# EAGLE design EMG (EAGLE 8.6.0)
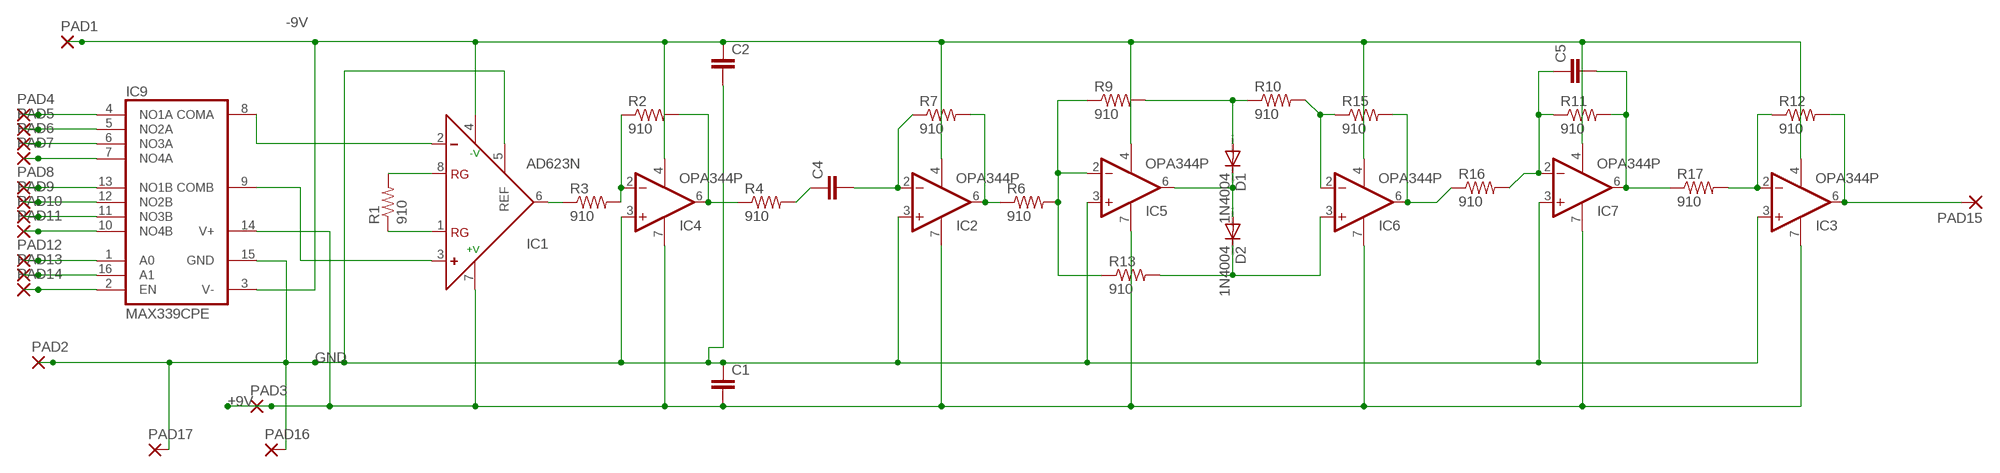
[diagram p0: schematic, sheet 1]

## Parts
C1  C2,5-3  [C2.5-3]
C2  C2,5-3  [C2.5-3]
C4  C2,5-3  [C2.5-3]
C5  C2,5-3  [C2.5-3]
D1  1N4004  [DO41-10]
D2  1N4004  [DO41-10]
IC1  AD623N  [DIL08]
IC2  OPA344P  [DIL08]
IC3  OPA344P  [DIL08]
IC4  OPA344P  [DIL08]
IC5  OPA344P  [DIL08]
IC6  OPA344P  [DIL08]
IC7  OPA344P  [DIL08]
IC9  MAX339CPE  [DIL16]
PAD1  2,15/1,0  [2,15/1,0]
PAD2  2,15/1,0  [2,15/1,0]
PAD3  2,15/1,0  [2,15/1,0]
PAD4  2,15/1,0  [2,15/1,0]
PAD5  2,15/1,0  [2,15/1,0]
PAD6  2,15/1,0  [2,15/1,0]
PAD7  2,15/1,0  [2,15/1,0]
PAD8  2,15/1,0  [2,15/1,0]
PAD9  2,15/1,0  [2,15/1,0]
PAD10  2,15/1,0  [2,15/1,0]
PAD11  2,15/1,0  [2,15/1,0]
PAD12  2,15/1,0  [2,15/1,0]
PAD13  2,15/1,0  [2,15/1,0]
PAD14  2,15/1,0  [2,15/1,0]
PAD15  2,15/1,0  [2,15/1,0]
PAD16  2,15/1,0  [2,15/1,0]
PAD17  2,15/1,0  [2,15/1,0]
R1  910  R-US_0204/7  [0204/7]
R2  910  R-US_0204/7  [0204/7]
R3  910  R-US_0204/7  [0204/7]
R4  910  R-US_0204/7  [0204/7]
R6  910  R-US_0204/7  [0204/7]
R7  910  R-US_0204/7  [0204/7]
R9  910  R-US_0204/7  [0204/7]
R10  910  R-US_0204/7  [0204/7]
R11  910  R-US_0204/7  [0204/7]
R12  910  R-US_0204/7  [0204/7]
R13  910  R-US_0204/7  [0204/7]
R15  910  R-US_0204/7  [0204/7]
R16  910  R-US_0204/7  [0204/7]
R17  910  R-US_0204/7  [0204/7]

## Nets
+9V: C1.2 IC1.7(+V) IC2.7(V+) IC3.7(V+) IC4.7(V+) IC5.7(V+) IC6.7(V+) IC7.7(V+) IC9.14(V+) PAD3.1(P)
-9V: C2.1 IC1.4(-V) IC2.4(V-) IC3.4(V-) IC4.4(V-) IC5.4(V-) IC6.4(V-) IC7.4(V-) IC9.3(V-) PAD1.1(P)
GND: C1.1 C2.2 IC1.5(REF) IC2.3(+IN) IC3.3(+IN) IC4.3(+IN) IC5.3(+IN) IC7.3(+IN) IC9.15(GND) PAD2.1(P) PAD16.1(P) PAD17.1(P)
N$1: IC1.8(RG) R1.2
N$2: IC1.1(RG) R1.1
N$3: IC1.6(OUT) R3.1
N$4: IC4.2(-IN) R2.1 R3.2
N$6: IC4.6(OUT) R2.2 R4.1
N$7: C4.1 R4.2
N$8: C4.2 IC2.2(-IN) R7.1
N$9: IC5.2(-IN) R6.2 R9.1 R13.1
N$10: D1.A R9.2 R10.1
N$11: IC2.6(OUT) R6.1 R7.2
N$12: IC6.6(OUT) R15.2 R16.1
N$13: C5.1 IC7.2(-IN) R11.1 R16.2
N$14: C5.2 IC7.6(OUT) R11.2 R17.1
N$15: IC3.2(-IN) R12.1 R17.2
N$16: IC3.6(OUT) PAD15.1(P) R12.2
N$17: D2.C IC6.3(+IN) R13.2
N$18: D1.C D2.A IC5.6(OUT)
N$19: IC6.2(-IN) R10.2 R15.1
N$20: IC1.2(-) IC9.8(COMA)
N$21: IC1.3(+) IC9.9(COMB)
N$22: IC9.10(NO4B) PAD11.1(P)
N$23: IC9.4(NO1A) PAD4.1(P)
N$24: IC9.5(NO2A) PAD5.1(P)
N$25: IC9.6(NO3A) PAD6.1(P)
N$26: IC9.7(NO4A) PAD7.1(P)
N$27: IC9.13(NO1B) PAD8.1(P)
N$28: IC9.11(NO3B) PAD10.1(P)
N$29: IC9.12(NO2B) PAD9.1(P)
N$30: IC9.1(A0) PAD12.1(P)
N$31: IC9.16(A1) PAD13.1(P)
N$32: IC9.2(EN) PAD14.1(P)

## Library data of the parts
C1 C2 C4 C5 = capacitor-wima:C: CAPACITOR naming: grid - package width
D1 D2 = diode:1N4004: DIODE general purpose rectifier, 1 A
IC1 = analog-devices:AD623: Single-Supply, Rail-to-Rail, Low Cost Instrumentation Amplifier Source: http://www.analog.com/static/imported-files/data_sheets/AD623.pdf; MF: ALTERA CORPORATION; MPN: AD623ANZ; OC_FARNELL: 9603700; OC_NEWARK: 59K4402
IC2-IC7 = linear:OPA*: Single Operational Amplifier Low Power, Single-Supply, Rail-To-Rail Operational Amplifier Source: http://focus.ti.com/lit/ds/symlink/opa2345.pdf
IC9 = maxim:MAX339CPE: MULTIPLEXER; MPN: MAX339CPE+; OC_FARNELL: unknown; OC_NEWARK: 05M8545
PAD1-PAD17 = wirepad:2,15/1,0: THROUGH-HOLE PAD
R1-R4 R6 R7 R9-R13 R15-R17 = rcl:R-US_: RESISTOR, American symbol; SPICEPREFIX: R

## Board
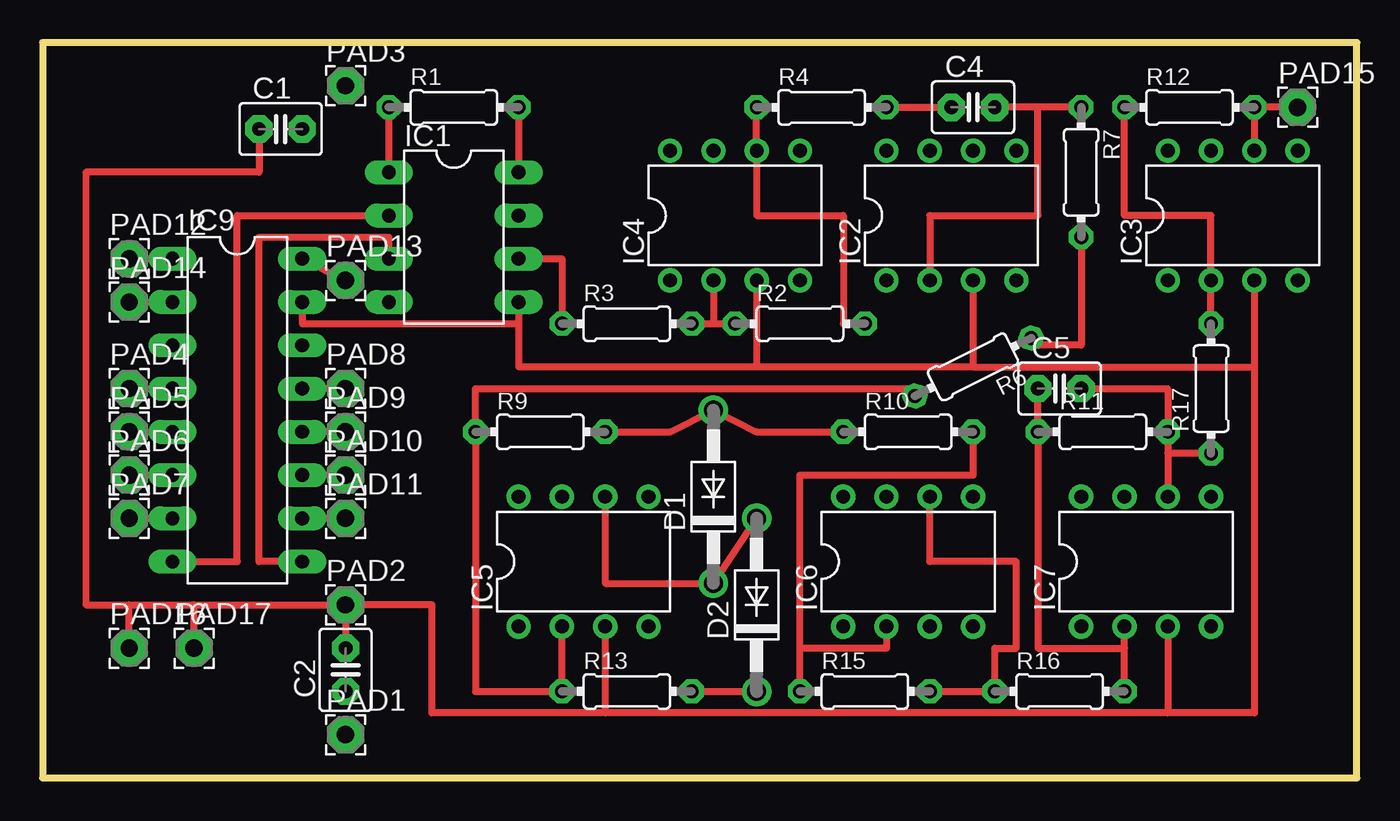
[diagram p1: board, top side]
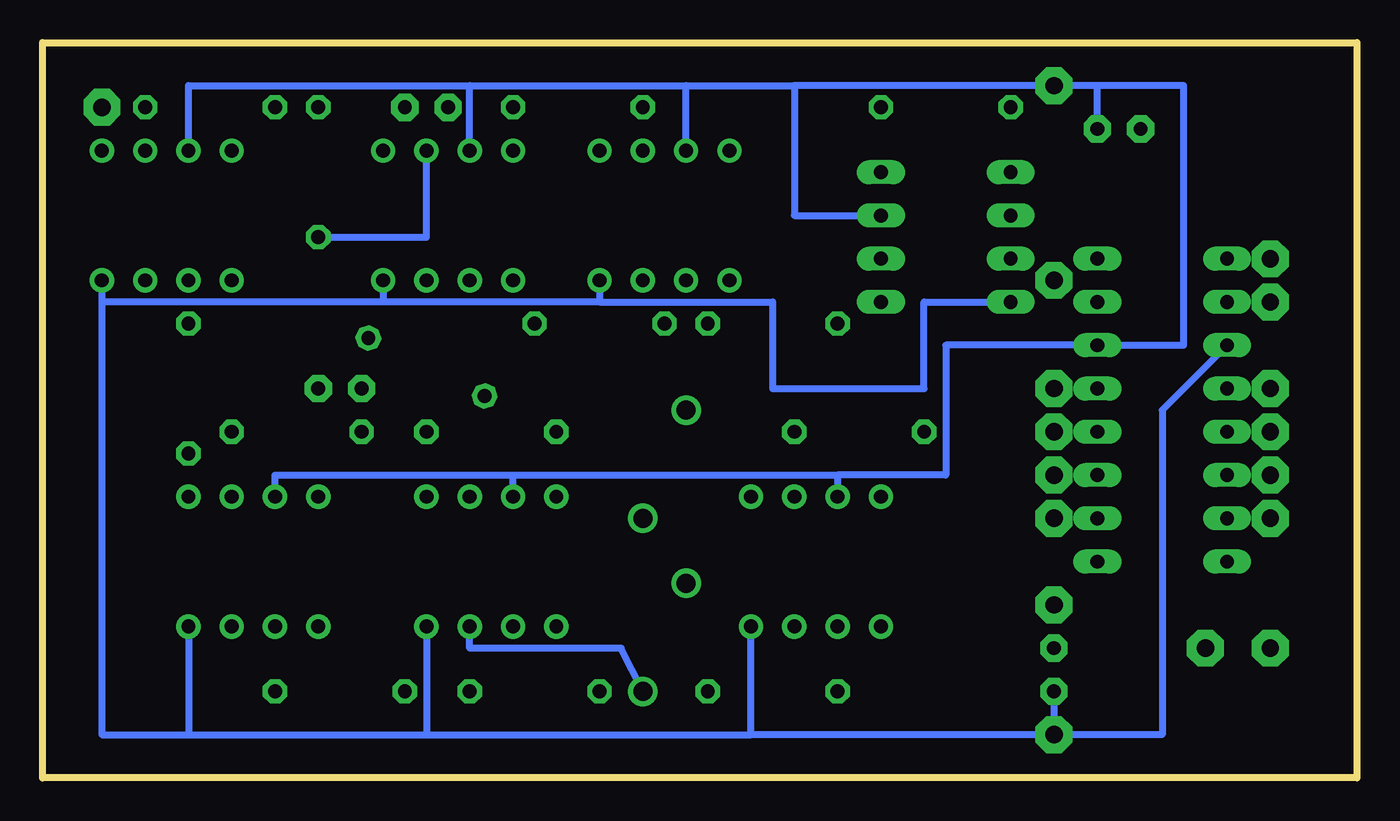
[diagram p2: board, bottom side, seen from below]

Size 77.14 x 43.17 mm. Coordinates in mm from the lower left corner, seen from the top.
Outline: 0,0 77.14,0 77.14,43.17 0,43.17 0,0
Copper layers (1*16): Top 0.035mm / dielectric 1.5mm / Bottom 0.035mm
Design rules "SparkFun *": minimum track width 15.75mil, minimum drill 15.75mil, track to track 8mil, track to pad 8mil, pad to pad 8mil, via to via 8mil, smd to smd 8mil, copper to edge 8mil, drill to drill 8mil, minimum pad ring 12mil, minimum via ring 10mil, stop-mask expansion 4mil, vias tented up to drill 20mil, thermal gap 10mil

### Footprints (pad centres in the part's own frame; a part is rotated, then mirrored left to right if it is on the bottom)
C2.5-3 = drill 0.813 pad 1.6 octagon: 1 -1.27,0; 2 1.27,0
DO41-10 = drill 1.118: A 5.08,0; C -5.08,0
DIL08 = drill 0.813 long: 1 -3.81,-3.81; 2 -1.27,-3.81; 3 1.27,-3.81; 4 3.81,-3.81; 5 3.81,3.81; 6 1.27,3.81; 7 -1.27,3.81; 8 -3.81,3.81
DIL08' = drill 0.813 pad 1.27: 1 -3.81,-3.81; 2 -1.27,-3.81; 3 1.27,-3.81; 4 3.81,-3.81; 5 3.81,3.81; 6 1.27,3.81; 7 -1.27,3.81; 8 -3.81,3.81
DIL16 = drill 0.813 long: 1 -8.89,-3.81; 2 -6.35,-3.81; 3 -3.81,-3.81; 4 -1.27,-3.81; 5 1.27,-3.81; 6 3.81,-3.81; 7 6.35,-3.81; 8 8.89,-3.81; 9 8.89,3.81; 10 6.35,3.81; 11 3.81,3.81; 12 1.27,3.81; 13 -1.27,3.81; 14 -3.81,3.81; 15 -6.35,3.81; 16 -8.89,3.81
2,15/1,0 = drill 1.016 pad 2.159 octagon: 1 0,0
0204/7 = drill 0.813 octagon: 1 -3.81,0; 2 3.81,0

### Placement (x,y rotation side)
C1  13.97,38.1 0 top
C2  17.78,6.35 90 top
C4  54.61,39.37 0 top
C5  59.69,22.86 0 top
D1  39.37,16.51 90 top
D2  41.91,10.16 90 top
IC1  24.13,31.75 270 top
IC2  OPA344P  [DIL08']  53.34,33.02 0 top
IC3  OPA344P  [DIL08']  69.85,33.02 0 top
IC4  OPA344P  [DIL08']  40.64,33.02 0 top
IC5  OPA344P  [DIL08']  31.75,12.7 0 top
IC6  OPA344P  [DIL08']  50.8,12.7 0 top
IC7  OPA344P  [DIL08']  64.77,12.7 0 top
IC9  11.43,21.59 270 top
PAD1  17.78,2.54 0 top
PAD2  17.78,10.16 0 top
PAD3  17.78,40.64 0 top
PAD4  5.08,22.86 0 top
PAD5  5.08,20.32 0 top
PAD6  5.08,17.78 0 top
PAD7  5.08,15.24 0 top
PAD8  17.78,22.86 0 top
PAD9  17.78,20.32 0 top
PAD10  17.78,17.78 0 top
PAD11  17.78,15.24 0 top
PAD12  5.08,30.48 0 top
PAD13  17.78,29.21 0 top
PAD14  5.08,27.94 0 top
PAD15  73.66,39.37 0 top
PAD16  5.08,7.62 0 top
PAD17  8.89,7.62 0 top
R1  24.13,39.37 0 top
R2  44.45,26.67 0 top
R3  34.29,26.67 0 top
R4  45.72,39.37 0 top
R6  54.61,24.13 206.5 top
R7  60.96,35.56 270 top
R9  29.21,20.32 0 top
R10  50.8,20.32 0 top
R11  62.23,20.32 0 top
R12  67.31,39.37 0 top
R13  34.29,5.08 0 top
R15  48.26,5.08 0 top
R16  59.69,5.08 0 top
R17  68.58,22.86 90 top

### Tracks (layer width: path | path; a pad name or v marks a point on that pad's centre or on a via)
+9V
  Bottom 0.406: 15.24,40.64 10.16,40.64 10.16,25.4 IC9.14 24.13,25.4 24.13,17.78 30.48,17.78 | 15.24,40.64 PAD3.1 33.02,40.64 | C1.2 15.24,40.64 | 33.02,40.64 33.02,33.02 IC1.7 | IC4.7 39.37,40.64 | 39.37,40.64 33.02,40.64 | IC2.7 52.07,40.64 | 52.07,40.64 39.37,40.64 | IC3.7 68.58,40.64 52.07,40.64 | 30.48,17.78 IC5.7 | IC6.7 49.53,17.78 | 49.53,17.78 30.48,17.78 | IC7.7 63.5,17.78 49.53,17.78
-9V
  Bottom 0.406: IC9.3 11.43,21.59 11.43,2.54 PAD1.1 | C2.1 PAD1.1 | PAD1.1 35.56,2.54 | 35.56,2.54 IC5.4 | 54.61,2.54 35.56,2.54 | IC6.4 54.61,2.54 | IC7.4 68.58,2.54 | 68.58,2.54 54.61,2.54 | IC3.4 73.66,27.94 | 73.66,27.94 73.66,2.54 68.58,2.54 | IC2.4 57.15,27.94 | 57.15,27.94 73.66,27.94 | IC4.4 44.45,27.94 | 44.45,27.94 57.15,27.94 | 44.45,27.94 34.29,27.94 34.29,22.86 25.4,22.86 25.4,27.94 IC1.4
GND
  Top 0.406: 5.08,10.16 2.54,10.16 2.54,35.56 12.7,35.56 C1.1 | 5.08,10.16 8.89,10.16 | 8.89,10.16 PAD2.1 | PAD2.1 C2.2 | PAD17.1 8.89,10.16 | IC5.3 33.02,3.81 | 33.02,3.81 22.86,3.81 22.86,10.16 PAD2.1 | IC4.3 41.91,24.13 | 41.91,24.13 27.94,24.13 27.94,26.67 | IC1.5 27.94,26.67 | IC2.3 54.61,24.13 | 54.61,24.13 41.91,24.13 | 66.04,3.81 33.02,3.81 | IC7.3 66.04,3.81 | 66.04,3.81 71.12,3.81 71.12,24.13 | IC3.3 71.12,24.13 | 54.61,24.13 71.12,24.13 | PAD16.1 5.08,10.16 | IC9.15 15.24,26.67 27.94,26.67
N$1
  Top 0.406: R1.2 IC1.8
N$2
  Top 0.406: R1.1 IC1.1
N$3
  Top 0.406: IC1.6 30.48,30.48 R3.1
N$4
  Top 0.406: R3.2 39.37,26.67 | 39.37,26.67 R2.1 | IC4.2 39.37,26.67
N$6
  Top 0.406: R4.1 IC4.6 41.91,33.02 46.99,33.02 46.99,26.67 R2.2
N$7
  Top 0.406: R4.2 C4.1
N$8
  Top 0.406: IC2.2 52.07,33.02 58.42,33.02 58.42,39.37 | R7.1 58.42,39.37 | 58.42,39.37 C4.2
N$9
  Top 0.406: IC5.2 R13.1 25.4,5.08 R9.1 25.4,22.86 50.77,22.86 R6.2
N$10
  Top 0.406: R9.2 36.83,20.32 D1.A 41.91,20.32 R10.1
N$11
  Top 0.406: R7.2 60.96,25.4 58.45,25.4 R6.1
  Bottom 0.406: R7.2 54.61,31.75 IC2.6
N$12
  Top 0.406: IC6.6 52.07,12.7 57.15,12.7 57.15,7.62 55.88,7.62 R16.1 R15.2
N$13
  Top 0.406: C5.1 R11.1 58.42,7.62 63.5,7.62 | R16.2 63.5,7.62 | 63.5,7.62 IC7.2
N$14
  Top 0.406: 66.04,19.05 R11.2 66.04,22.86 C5.2 | 66.04,19.05 IC7.6 | R17.1 66.04,19.05
N$15
  Top 0.406: R17.2 IC3.2 68.58,33.02 63.5,33.02 R12.1
N$16
  Top 0.406: PAD15.1 R12.2 IC3.6
N$17
  Top 0.406: R13.2 D2.C
  Bottom 0.406: IC6.3 52.07,7.62 43.18,7.62 D2.C
N$18
  Top 0.406: IC5.6 33.02,11.43 D1.C D2.A
N$19
  Top 0.406: R10.2 54.61,17.78 44.45,17.78 44.45,7.62 | IC6.2 49.53,7.62 44.45,7.62 | R15.1 44.45,7.62
N$20
  Top 0.406: IC9.8 11.43,12.7 11.43,33.02 IC1.2
N$21
  Top 0.406: IC9.9 12.7,12.7 12.7,31.75 20.32,31.75 IC1.3
N$22
  Top 0.406: PAD11.1 IC9.10
N$23
  Top 0.406: PAD4.1 IC9.4
N$24
  Top 0.406: PAD5.1 IC9.5
N$25
  Top 0.406: PAD6.1 IC9.6
N$26
  Top 0.406: PAD7.1 IC9.7
N$27
  Top 0.406: PAD8.1 IC9.13
N$28
  Top 0.406: PAD10.1 IC9.11
N$29
  Top 0.406: PAD9.1 IC9.12
N$30
  Top 0.406: PAD12.1 IC9.1
N$31
  Top 0.406: IC9.16 PAD13.1
N$32
  Top 0.406: PAD14.1 IC9.2